# Altium schematic sheet [1]MCU.SchDoc
size B
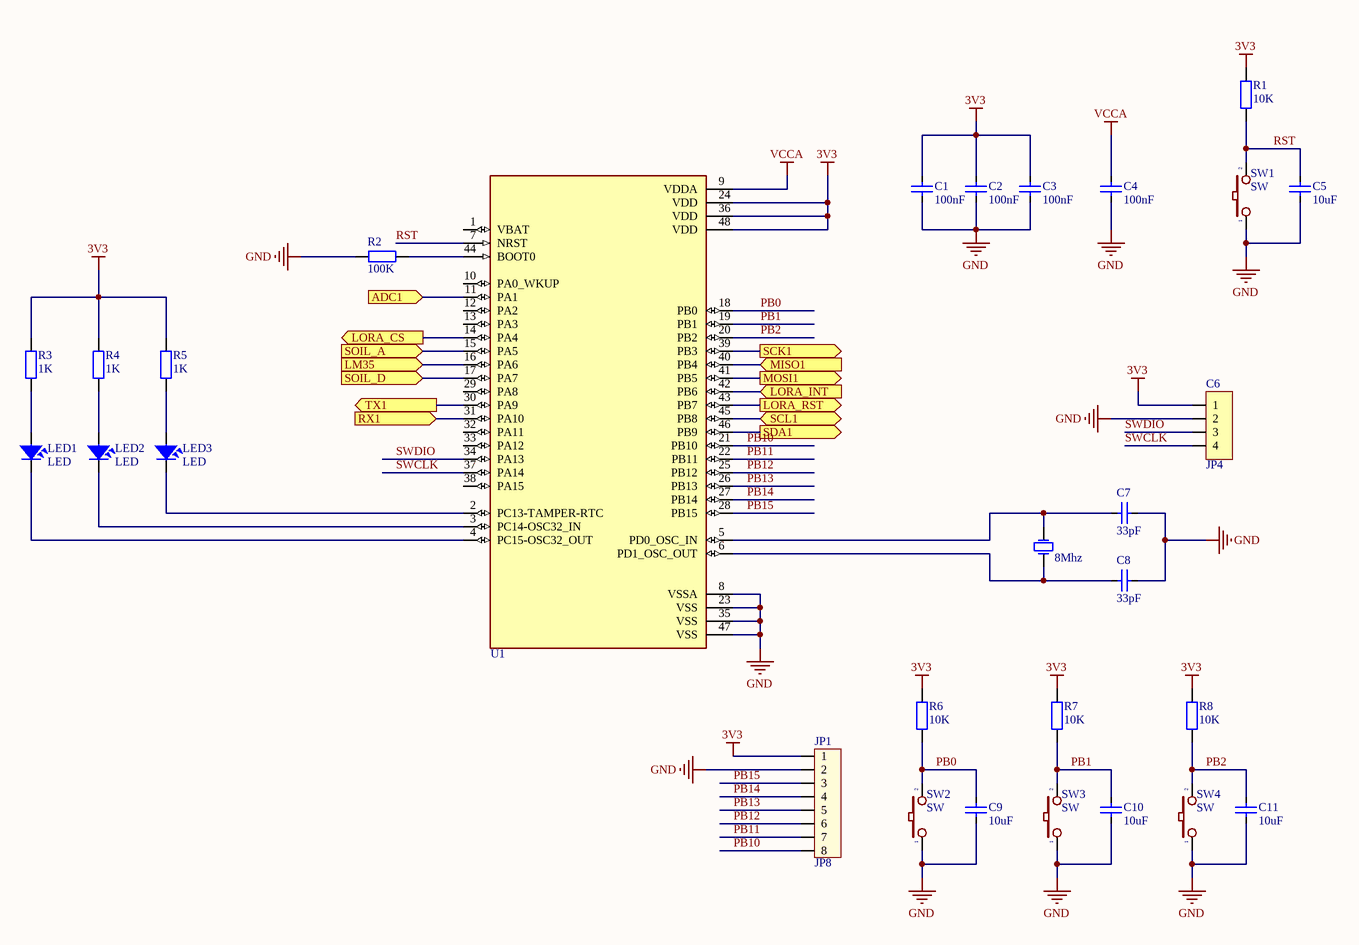
[diagram p0: [1]MCU.SchDoc]

## Parts
C1  100nF  [CAP_0805]
C2  100nF  [CAP_0805]
C3  100nF  [CAP_0805]
C4  100nF  [CAP_0805]
C5  10uF  [CAP_0805]
C6  JP4  [JP4-C1T]
C7  33pF  [CAP_0805]
C8  33pF  [CAP_0805]
C9  10uF  [CAP_0805]
C10  10uF  [CAP_0805]
C11  10uF  [CAP_0805]
JP1  JP8  [CON8]
LED1  LED  [LED-0805-Blue]
LED2  LED  [LED-0805-Blue]
LED3  LED  [LED-0805-Blue]
R1  10K  [RES-SMD-0805]
R2  100K  [RES_SMD_0805]
R3  1K  [RES_SMD_0805]
R4  1K  [RES_SMD_0805]
R5  1K  [RES_SMD_0805]
R6  10K  [RES-SMD-0805]
R7  10K  [RES-SMD-0805]
R8  10K  [RES-SMD-0805]
SW1  SW  [SW2]
SW2  SW  [SW2]
SW3  SW  [SW2]
SW4  SW  [SW2]
U1  STM32  [LQFP 48]  (value not drawn)
Y1  8Mhz  [XTAL]

## Ports
ADC1 (in), LM35 (in), LORA_CS (out), LORA_INT (in), LORA_RST (out), MISO1 (in), MOSI1 (out), RX1 (in), SCK1 (out), SCL1 (bidir), SDA1 (out), SOIL_A (in), SOIL_D (in), TX1 (out)

## Nets
3V3: C1.2 C2.2 C3.2 C6.1 JP1.1 R1.1 R3.1 R4.1 R5.1 R6.1 R7.1 R8.1 U1.24(VDD) U1.36(VDD) U1.48(VDD)
GND: C1.1 C2.1 C3.1 C4.1 C5.1 C6.2 C7.2 C8.2 C9.1 C10.1 C11.1 JP1.2 R2.2 SW1.1 SW2.1 SW3.1 SW4.1 U1.8(VSSA) U1.23(VSS) U1.35(VSS) U1.47(VSS)
VCCA: C4.2 U1.9(VDDA)
ADC1: U1.11(PA1) ; port ADC1
LM35: U1.16(PA6) ; port LM35
LORA_CS: U1.14(PA4) ; port LORA_CS
LORA_INT: U1.42(PB6) ; port LORA_INT
LORA_RST: U1.43(PB7) ; port LORA_RST
MISO1: U1.40(PB4) ; port MISO1
MOSI1: U1.41(PB5) ; port MOSI1
PB0: C9.2 R6.2 SW2.2 U1.18(PB0)
PB1: C10.2 R7.2 SW3.2 U1.19(PB1)
PB2: C11.2 R8.2 SW4.2 U1.20(PB2)
PB10: JP1.8 U1.21(PB10)
PB11: JP1.7 U1.22(PB11)
PB12: JP1.6 U1.25(PB12)
PB13: JP1.5 U1.26(PB13)
PB14: JP1.4 U1.27(PB14)
PB15: JP1.3 U1.28(PB15)
RST: C5.2 R1.2 SW1.2 U1.7(NRST)
RX1: U1.31(PA10) ; port RX1
SCK1: U1.39(PB3) ; port SCK1
SCL1: U1.45(PB8) ; port SCL1
SDA1: U1.46(PB9) ; port SDA1
SOIL_A: U1.15(PA5) ; port SOIL_A
SOIL_D: U1.17(PA7) ; port SOIL_D
SWCLK: C6.4 U1.37(PA14)
SWDIO: C6.3 U1.34(PA13)
TX1: U1.30(PA9) ; port TX1
NetC7_1: C7.1 U1.5(PD0_OSC_IN) Y1.2(OSC2)
NetC8_1: C8.1 U1.6(PD1_OSC_OUT) Y1.1(OSC1)
NetLED1_1: LED1.1 R3.2
NetLED1_2: LED1.2 U1.4(PC15-OSC32_OUT)
NetLED2_1: LED2.1 R4.2
NetLED2_2: LED2.2 U1.3(PC14-OSC32_IN)
NetLED3_1: LED3.1 R5.2
NetLED3_2: LED3.2 U1.2(PC13-TAMPER-RTC)
NetR2_1: R2.1 U1.44(BOOT0)

Not connected (* = marked no-connect by the designer): U1 1(VBAT) 10(PA0_WKUP) 12(PA2) 13(PA3) 29(PA8) 32(PA11) 33(PA12) 38(PA15)

## Library data of the parts
C1-C5 C7-C11 = CapSMD: Capacitor; Value: 33p; Published: 8-Jun-2000; LatestRevisionDate: 17-Jul-2002; LatestRevisionNote: Re-released for DXP Platform.; PackageReference: RAD-0.3; Publisher: Altium Limited
C6 = JP4: WR-PHD 2.54 mm Angled Socket Header; Manufacturer: W¨¹rth Elektronik eiSos GmbH; partNo: 613004143121; ComponentLink1 Description: Manufacturer; ComponentLink2 Description: Datasheet; NoPins: 04; Created Date: 29 March 2013; ComponentLink1URL: http://www.we-online.com; ComponentLink2URL: http://katalog.we-online.de/em/datasheet/6130xx143121.pdf; Created by: Karrer Zheng
JP1 = Con8: Connector 8; Value: Connector 8
LED1-LED3 = LED: LED Single colour Green and Red; Value: LED 3 ly Single Colour
R1-R8 = Resistor - SMD: Resistor SMD; Manufacturer: Generic Components; Class: Passive; Published: 08/06/2000; Publisher: Altium Hobart Technology Centre
SW1-SW4 = SW2: Switch button 2 pin; Value: SW chip 2 pin
U1 = STM32F103C8T6: STM32 ARM-based 32-bit MCU with 64 Kbytes Flash, 64-pin LQFP, Industrial Temperature
Y1 = XTAL: Crystal Oscillator; Published: 8-Jun-2000; LatestRevisionDate: 17-Jul-2002; LatestRevisionNote: Re-released for DXP Platform.; PackageReference: R38; Publisher: Altium Limited